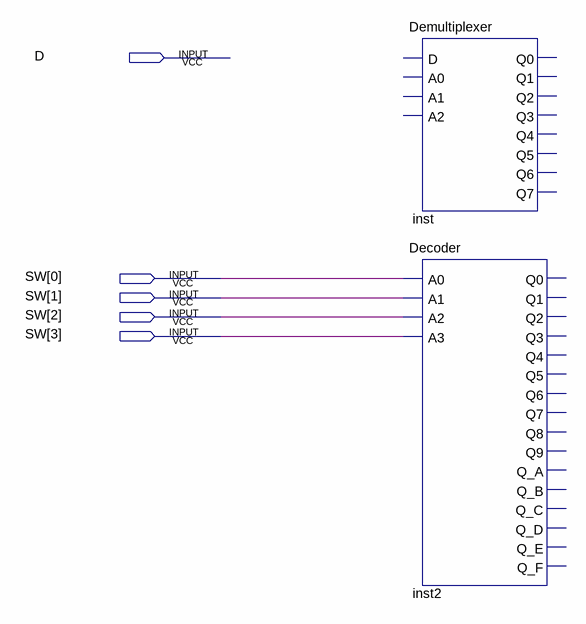
[diagram p0: schematic sheet]
// Quartus schematic EDWARD5_PROT.bdf as structural Verilog: 2 symbols, 5 pins
module EDWARD5_PROT (
  input  D,
  input  [3:0] SW
);

  Demultiplexer inst ();  // open: D, A0, A1, A2, Q0, Q1, Q2, Q3, Q4, Q5, Q6, Q7
  Decoder inst2 (
    .A0(SW[0]), .A1(SW[1]), .A2(SW[2]), .A3(SW[3]));  // open: Q0, Q1, Q2, Q3, Q4, Q5, Q6, Q7, Q8, Q9, Q_A, Q_B, Q_C, Q_D, Q_E, Q_F
endmodule
